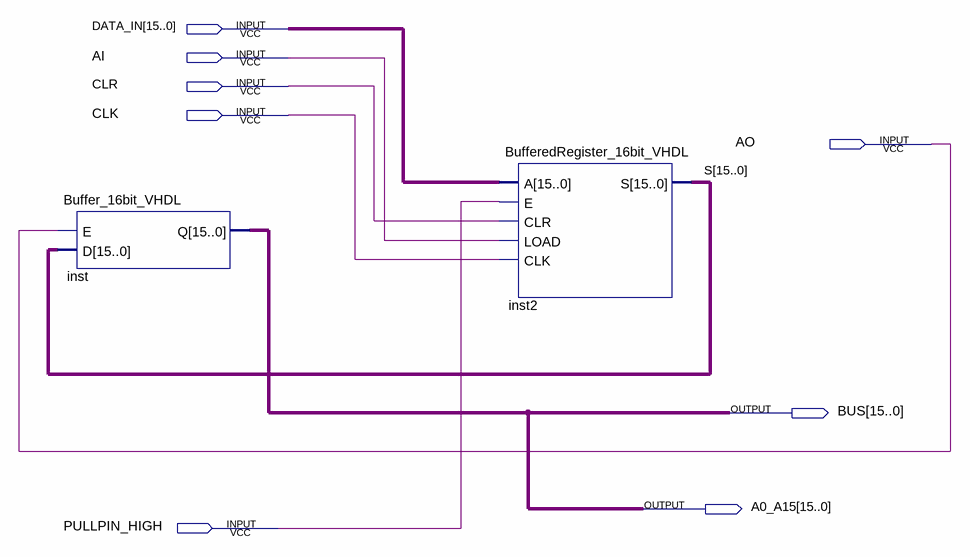
[diagram p0: schematic sheet]
// Quartus schematic AB_Reg_16bit.bdf as structural Verilog: 2 symbols, 8 pins
module AB_Reg_16bit (
  input  [15:0] DATA_IN,
  input  AI,
  input  CLR,
  input  CLK,
  input  AO,
  input  PULLPIN_HIGH,
  output [15:0] BUS,
  output [15:0] A0_A15
);

  wire [15:0] S;

  Buffer_16bit_VHDL inst (.E(AO), .D(S), .Q(A0_A15));
  BufferedRegister_16bit_VHDL inst2 (.A(DATA_IN), .E(PULLPIN_HIGH), .CLR(CLR), .LOAD(AI), .CLK(CLK), .S(S));

  assign BUS = A0_A15;
endmodule
